# EAGLE design RelayWing (EAGLE 8.6.3)
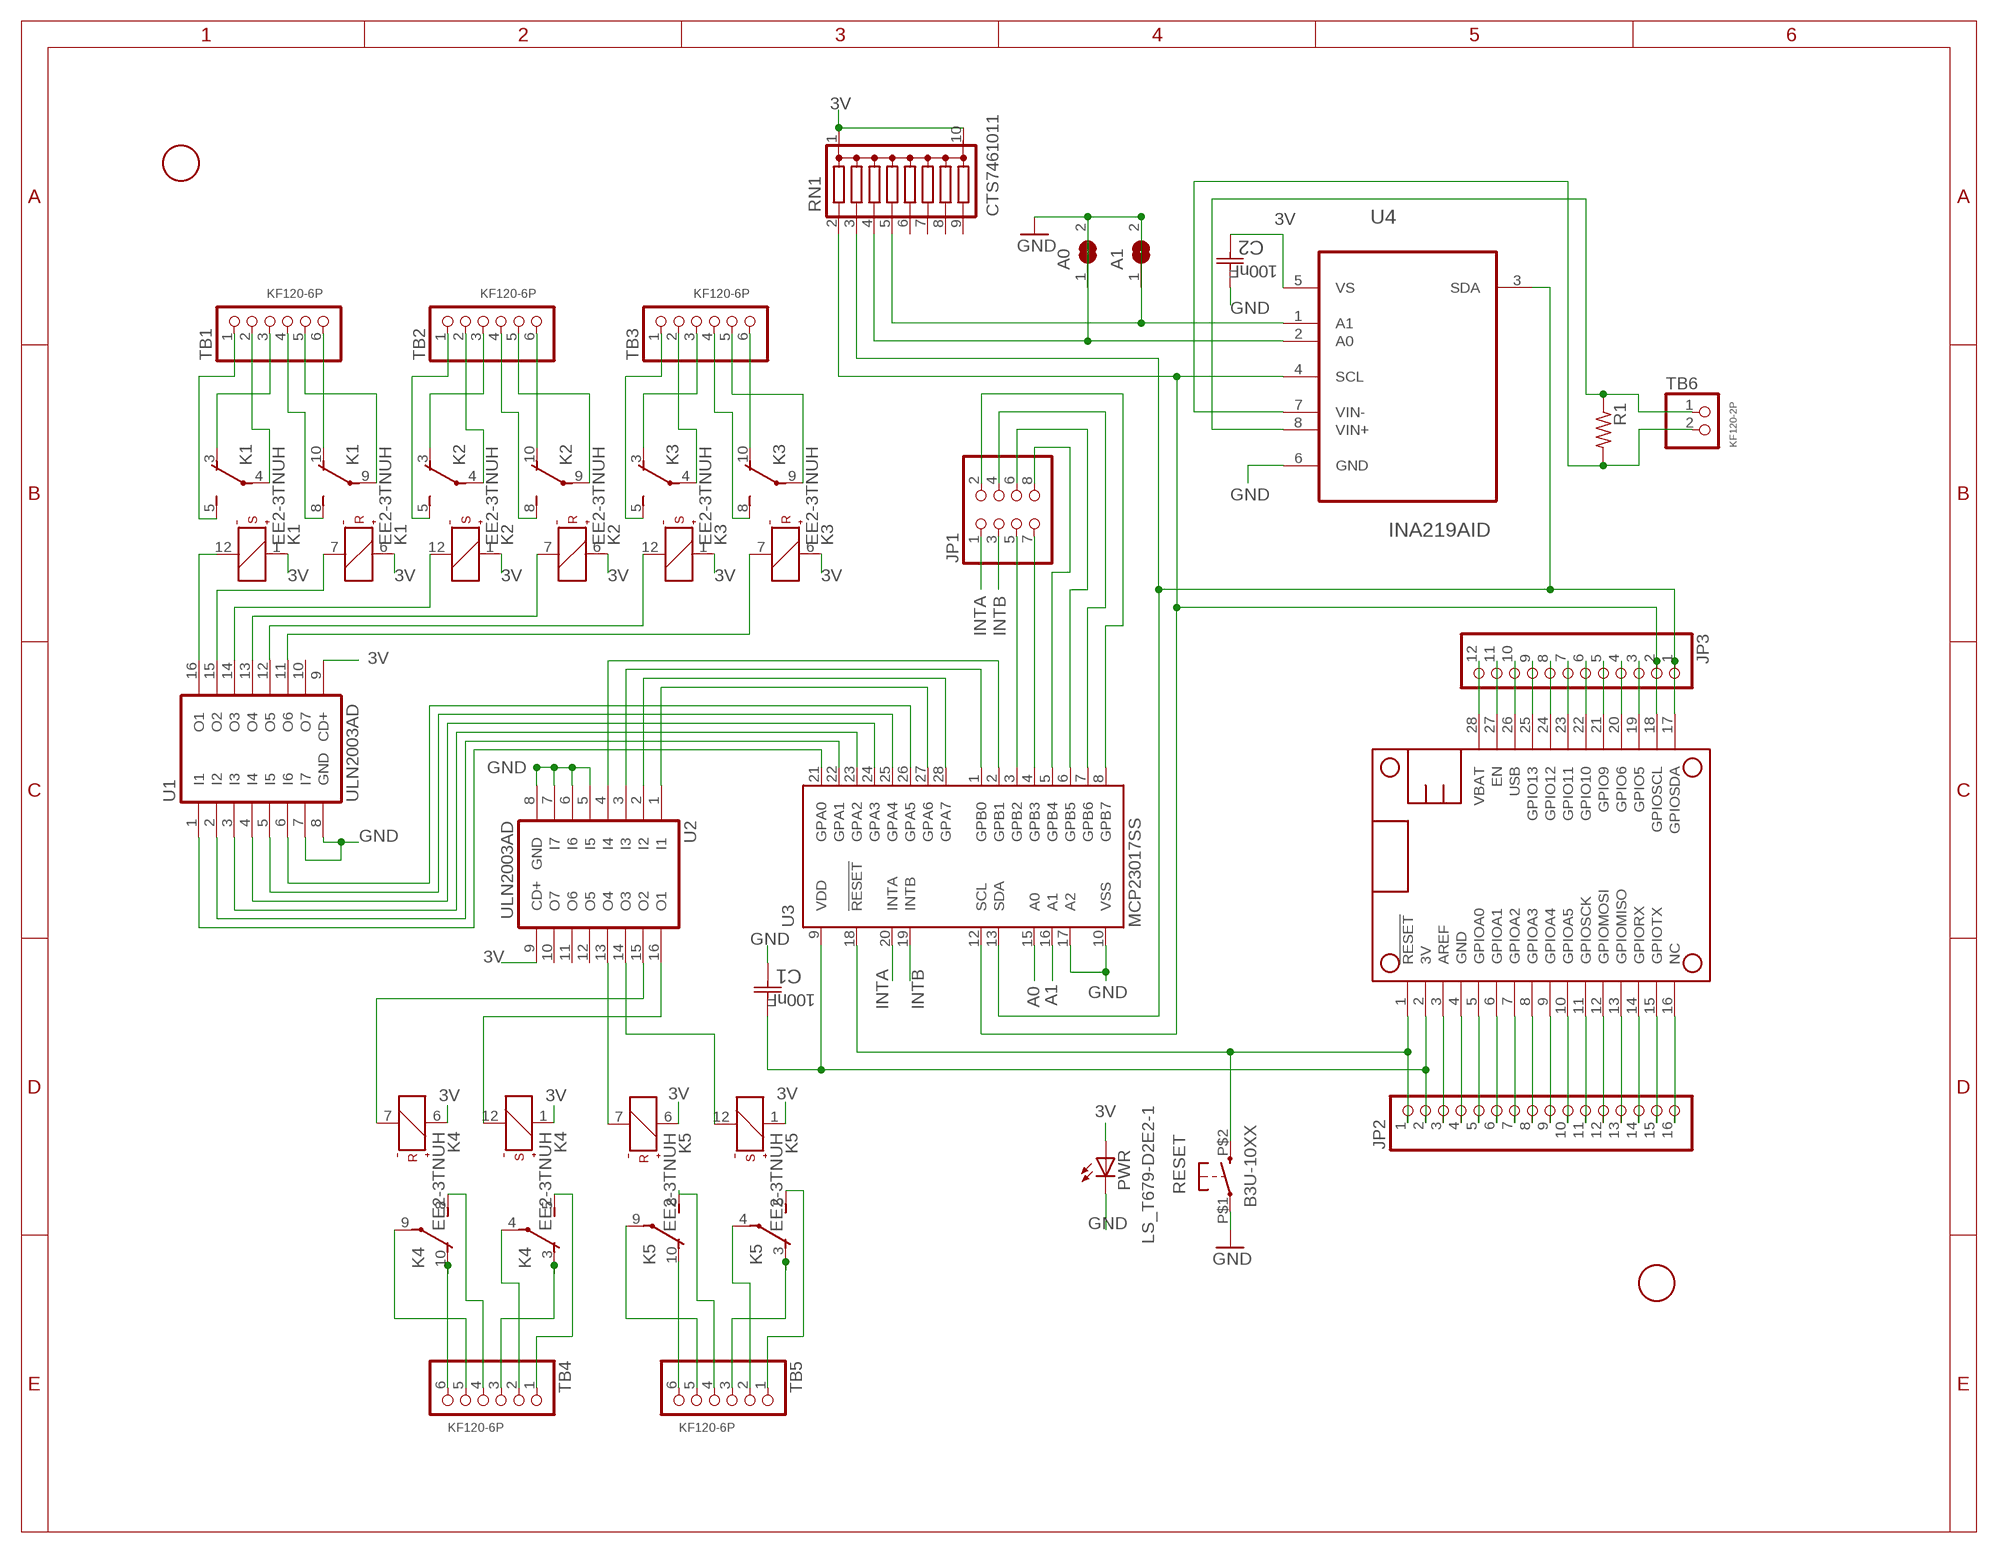
[diagram p0: schematic, sheet 1]

## Parts
A0  SJW  [SJW]
A1  SJW  [SJW]
C1  100nF  C0603C104K4RACTU  [CAPC1608X85N]
C2  100nF  C0603C104K4RACTU  [CAPC1608X85N]
JP1  PINHD-2X4  [2X04]
JP2  PINHD-1X16  [1X16]
JP3  PINHD-1X12  [1X12]
K1  EE2-3TNUH  [NUH]
K2  EE2-3TNUH  [NUH]
K3  EE2-3TNUH  [NUH]
K4  EE2-3TNUH  [NUH]
K5  EE2-3TNUH  [NUH]
MS1  FEATHERWING_NODIM  [FEATHERWING_DIM]
PWR  LS_T679-D2E2-1  [PLCC2]
R1  0.1  R-US_M3216  [M3216]
RESET  B3U-10XX  [B3U-10XX]
RN1  CTS7461011  [CTS746]
TB1  KF120-6P  [KF120-6P_ROUND]
TB2  KF120-6P  [KF120-6P_ROUND]
TB3  KF120-6P  [KF120-6P_ROUND]
TB4  KF120-6P  [KF120-6P_ROUND]
TB5  KF120-6P  [KF120-6P_ROUND]
TB6  KF120-2P  [KF120-2P_ROUND]
U1  ULN2003AD  [SO16]
U2  ULN2003AD  [SO16]
U3  MCP23017SS  [SSOP28]
U4  INA219AID  [SOIC127P600X175-8N]
U$2  FIDUCIAL  [FIDUCIAL_1MM]
U$3  FIDUCIAL  [FIDUCIAL_1MM]

## Nets
3V: C1.1(C1) C2.2(C2) JP2.2 K1.1(S:+) K1.6(R:+) K2.1(S:+) K2.6(R:+) K3.1(S:+) K3.6(R:+) K4.1(S:+) K4.6(R:+) K5.1(S:+) K5.6(R:+) MS1.2(3V) PWR.A RN1.1(1C) RN1.10(10C) U1.9(CD+) U2.9(CD+) U3.9(VDD) U4.5(VS)
A0: A0.1 RN1.4 U3.15(A0) U4.2(A0)
A1: A1.1 RN1.5 U3.16(A1) U4.1(A1)
GND: A0.2 A1.2 C1.2(C2) C2.1(C1) JP2.4 MS1.4(GND) PWR.C RESET.P$1(P) U1.7(I7) U1.8(GND) U2.5(I5) U2.6(I6) U2.7(I7) U2.8(GND) U3.10(VSS) U3.17(A2) U4.6(GND)
GPB2: JP1.5 U3.3(GPB2)
GPB3: JP1.7 U3.4(GPB3)
INTA: JP1.1 U3.20(INTA)
INTB: JP1.3 U3.19(INTB)
N$1: JP2.3 MS1.3(AREF)
N$2 [2A]: K4.8(2:S) TB4.4
N$3: JP2.5 MS1.5(GPIOA0)
N$4: JP2.6 MS1.6(GPIOA1)
N$5: JP2.7 MS1.7(GPIOA2)
N$6: JP2.8 MS1.8(GPIOA3)
N$7: JP2.9 MS1.9(GPIOA4)
N$8: JP2.10 MS1.10(GPIOA5)
N$9: JP2.11 MS1.11(GPIOSCK)
N$10: JP2.12 MS1.12(GPIOMOSI)
N$11: JP2.13 MS1.13(GPIOMISO)
N$12: JP2.14 MS1.14(GPIORX)
N$13: JP2.15 MS1.15(GPIOTX)
N$14: JP2.16 MS1.16(NC)
N$15: JP3.3 MS1.19(GPIO5)
N$16 [2A]: K1.5(1:S) TB1.1
N$17 [2A]: K2.5(1:S) TB2.1
N$18: JP2.1 MS1.1(!RESET) RESET.P$2(S) U3.18(!RESET)
N$19: JP3.4 MS1.20(GPIO6)
N$20: JP3.5 MS1.21(GPIO9)
N$21: JP3.6 MS1.22(GPIO10)
N$22: JP3.7 MS1.23(GPIO11)
N$23: JP3.8 MS1.24(GPIO12)
N$24 [coils 200mA]: K1.12(S:-) U1.16(O1)
N$25 [2A]: K4.10(2:O) TB4.6
N$26 [2A]: K2.4(1:P) TB2.2
N$27 [2A]: K2.3(1:O) TB2.3
N$28 [2A]: K1.3(1:O) TB1.3
N$29 [2A]: K1.10(2:O) TB1.6
N$30 [2A]: K1.4(1:P) TB1.2
N$32 [2A]: K1.9(2:P) TB1.5
N$33 [2A]: K2.9(2:P) TB2.5
N$34: K1.7(R:-) U1.15(O2)
N$35 [2A]: K1.8(2:S) TB1.4
N$36 [coils 200mA]: K2.12(S:-) U1.14(O3)
N$37: K2.7(R:-) U1.13(O4)
N$38: K3.12(S:-) U1.12(O5)
N$39 [coils 200mA]: K3.7(R:-) U1.11(O6)
N$40 [2A]: K4.4(1:P) TB4.2
N$42 [2A]: K4.5(1:S) TB4.1
N$43 [2A]: K5.4(1:P) TB5.2
N$44 [2A]: K5.5(1:S) TB5.1
N$45 [2A]: K5.10(2:O) TB5.6
N$46 [2A]: K5.9(2:P) TB5.5
N$47 [2A]: K5.8(2:S) TB5.4
N$49 [2A]: K4.9(2:P) TB4.5
N$50 [2A]: K5.3(1:O) TB5.3
N$51: JP3.9 MS1.25(GPIO13)
N$52 [2A]: K3.5(1:S) TB3.1
N$53 [2A]: K3.3(1:O) TB3.3
N$54 [2A]: K3.4(1:P) TB3.2
N$55 [2A]: K3.8(2:S) TB3.4
N$56 [2A]: K3.10(2:O) TB3.6
N$57 [2A]: K3.9(2:P) TB3.5
N$58 [coils 200mA]: K4.12(S:-) U2.16(O1)
N$59 [coils 200mA]: K4.7(R:-) U2.15(O2)
N$60 [coils 200mA]: K5.12(S:-) U2.14(O3)
N$61: JP3.11 MS1.27(EN)
N$62: U1.1(I1) U3.21(GPA0)
N$63: U1.2(I2) U3.22(GPA1)
N$64: U1.3(I3) U3.23(GPA2)
N$65: U1.5(I5) U3.25(GPA4)
N$66: U1.6(I6) U3.26(GPA5)
N$67: U1.4(I4) U3.24(GPA3)
N$68: U2.1(I1) U3.27(GPA6)
N$69: U2.2(I2) U3.28(GPA7)
N$70: U2.3(I3) U3.1(GPB0)
N$71: U2.4(I4) U3.2(GPB1)
N$72 [2A]: K2.8(2:S) TB2.4
N$73 [coils 200mA]: K5.7(R:-) U2.13(O4)
N$74: JP1.8 U3.5(GPB4)
N$75: JP1.6 U3.6(GPB5)
N$76: JP1.4 U3.7(GPB6)
N$77: JP1.2 U3.8(GPB7)
N$78 [2A]: K2.10(2:O) TB2.6
N$79 [2A]: K4.3(1:O) TB4.3
SCL: JP3.2 MS1.18(GPIOSCL) RN1.2 U3.12(SCL) U4.4(SCL)
SDA: JP3.1 MS1.17(GPIOSDA) RN1.3 U3.13(SDA) U4.3(SDA)
USB: JP3.10 MS1.26(USB)
VBAT: JP3.12 MS1.28(VBAT)
VIN+: R1.1 TB6.1 U4.8(VIN+)
VIN-: R1.2 TB6.2 U4.7(VIN-)
Unconnected: RN1.6 RN1.7 RN1.8 RN1.9 U1.10(O7) U2.10(O7) U2.11(O6) U2.12(O5)

## Library data of the parts
A0 A1 = jumper:SJ: SMD solder JUMPER
C1 C2 = Kemet_By_element14_Batch_1:C0603C104K4RACTU: CAPACITOR, 0603; MPN: C0603C104K4RACTU; OC_FARNELL: 1414610; OC_NEWARK: 19C6005; SUPPLIER: Kemet; TOLERANCE: ±10%; VOLTAGERATING: 16V
JP1 = pinhead:PINHD-2X4: PIN HEADER
JP2 = pinhead:PINHD-1X16: PIN HEADER
JP3 = pinhead:PINHD-1X12: PIN HEADER
K1-K5 = home:EE2-*T?: TX Relay 2 coil latching 2 AMP. HIGH CAPACITY RELAY WITH HIGH SURGE VOLTAGE & HIGH BREAKDOWN VOLTAGE Source: http://www.mew-europe.com/.. en_ds_61022_0001.pdf TX-S SMALL POLARIZED WITH HIGH SENSITIVITY 50mW Source: http://www.mew-europe.com/.. en_ds_61022_0022.pdf; PN: EE2-3TNUH
MS1 = microbuilder:FEATHERWING
PWR = led:*_T679-?-1: LC TOPLED® Low Current LED Source: http://catalog.osram-os.com .. LG_LS_LY_T679_OBS.pdf; COLOR: super-red
R1 = resistor:R-US_: RESISTOR, American symbol
RESET = home:B3U-10XX: OMRON SWITCH
RN1 = home:CTS7461011: Network Resistor CTS 753 Series Leadless Surface Mount Source: http://www.ctscorp.com/components/Datasheets/753.pdf Distributor: Digi Key
TB1-TB5 = home:KF120-6P: Kaweei KF120-6P 6-pin screw terminalblock, 0.1" spacing. Adafruit
TB6 = home:KF120-2P: Kaweei KF120-2P 2-pin screw terminal block, 0.1" spacing. Through-hole. Adafruit
U1 U2 = uln-udn:ULN2003A: DRIVER ARRAY
U3 = microchip:MCP23017: http://ww1.microchip.com/downloads/en/DeviceDoc/21952a.pdf Source: http://ww1.microchip.com/downloads/en/DeviceDoc/21952a.pdf; MF: MICROCHIP; MPN: MCP23017-E/SS; OC_FARNELL: 1467674; OC_NEWARK: 31K2960
U4 = home:INA219AID: CURRENT/ POWER MONITOR; MPN: INA219AID; OC_FARNELL: -; OC_NEWARK: 45P7635; PACKAGE: SOIC-8; SUPPLIER: Texas Instruments
U$2 U$3 = adafruit:FIDUCIAL: For use by pick and place machines to calibrate the vision/machine, 1mm By microbuilder.eu

## Net classes
0 default: width 0.203 mm, clearance 0.203 mm
1 2A: width 0.406 mm, clearance 0.203 mm
2 coils 200mA: width 0.203 mm, clearance 0.203 mm

## Board
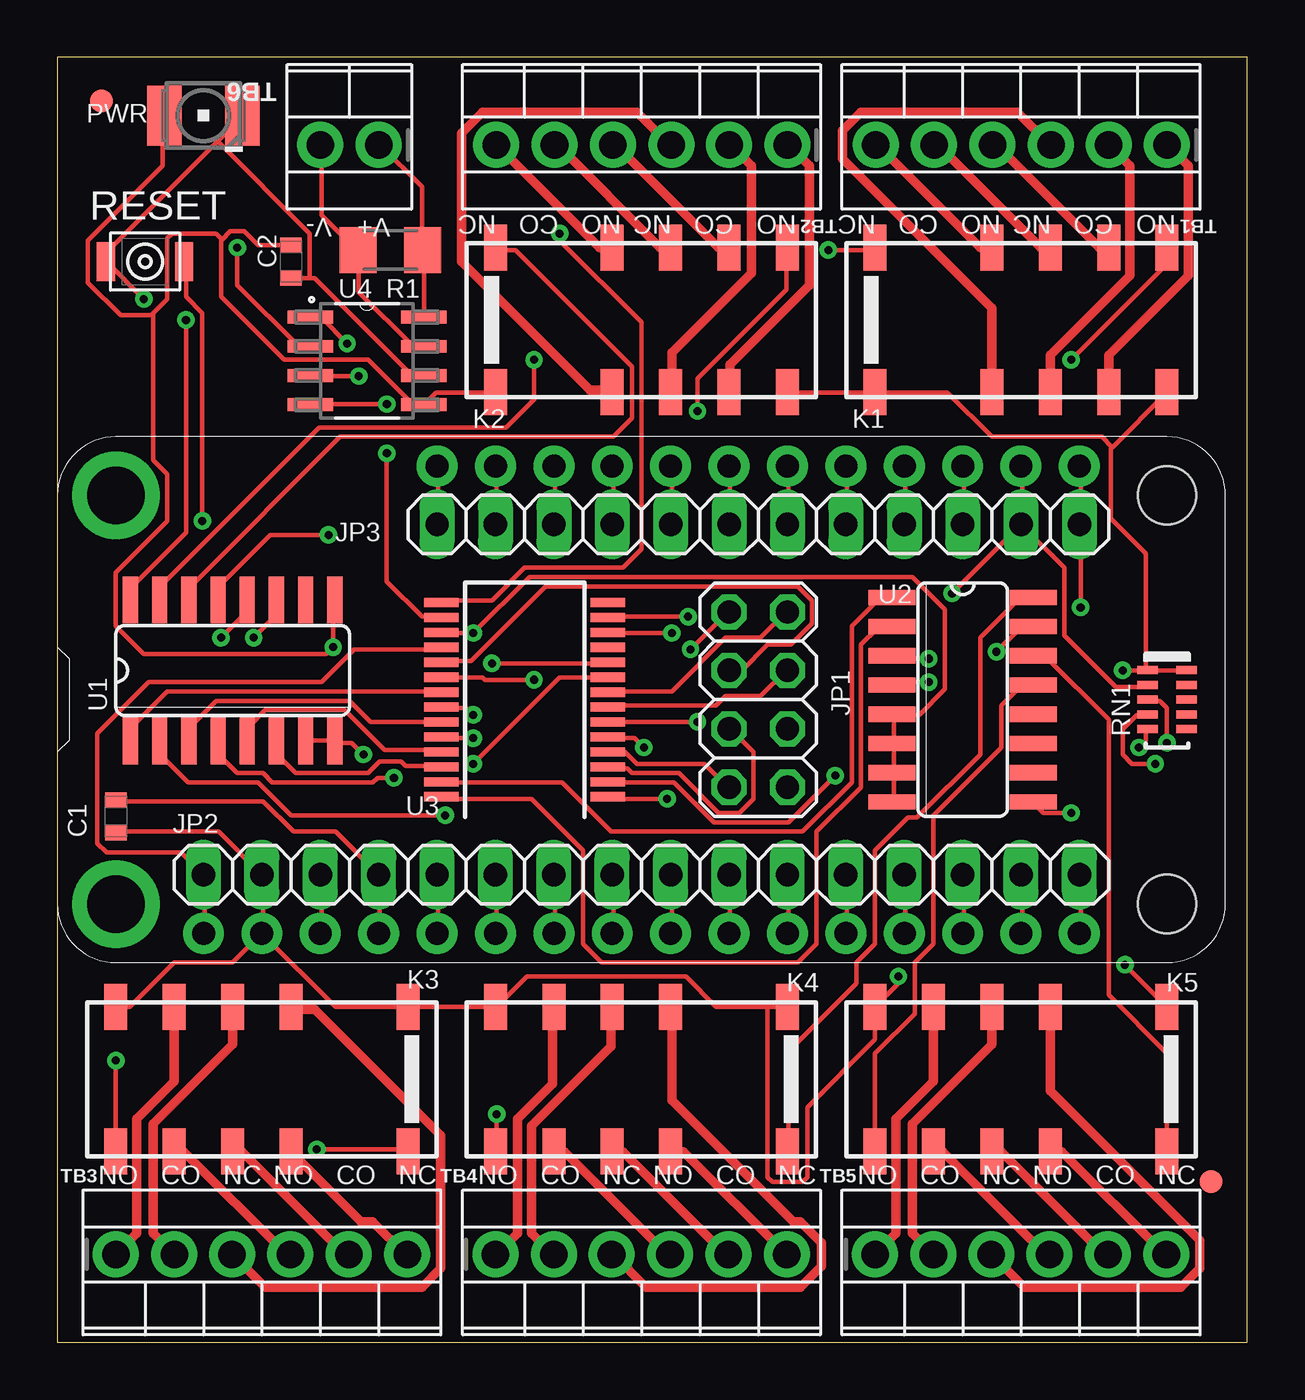
[diagram p1: board, top side]
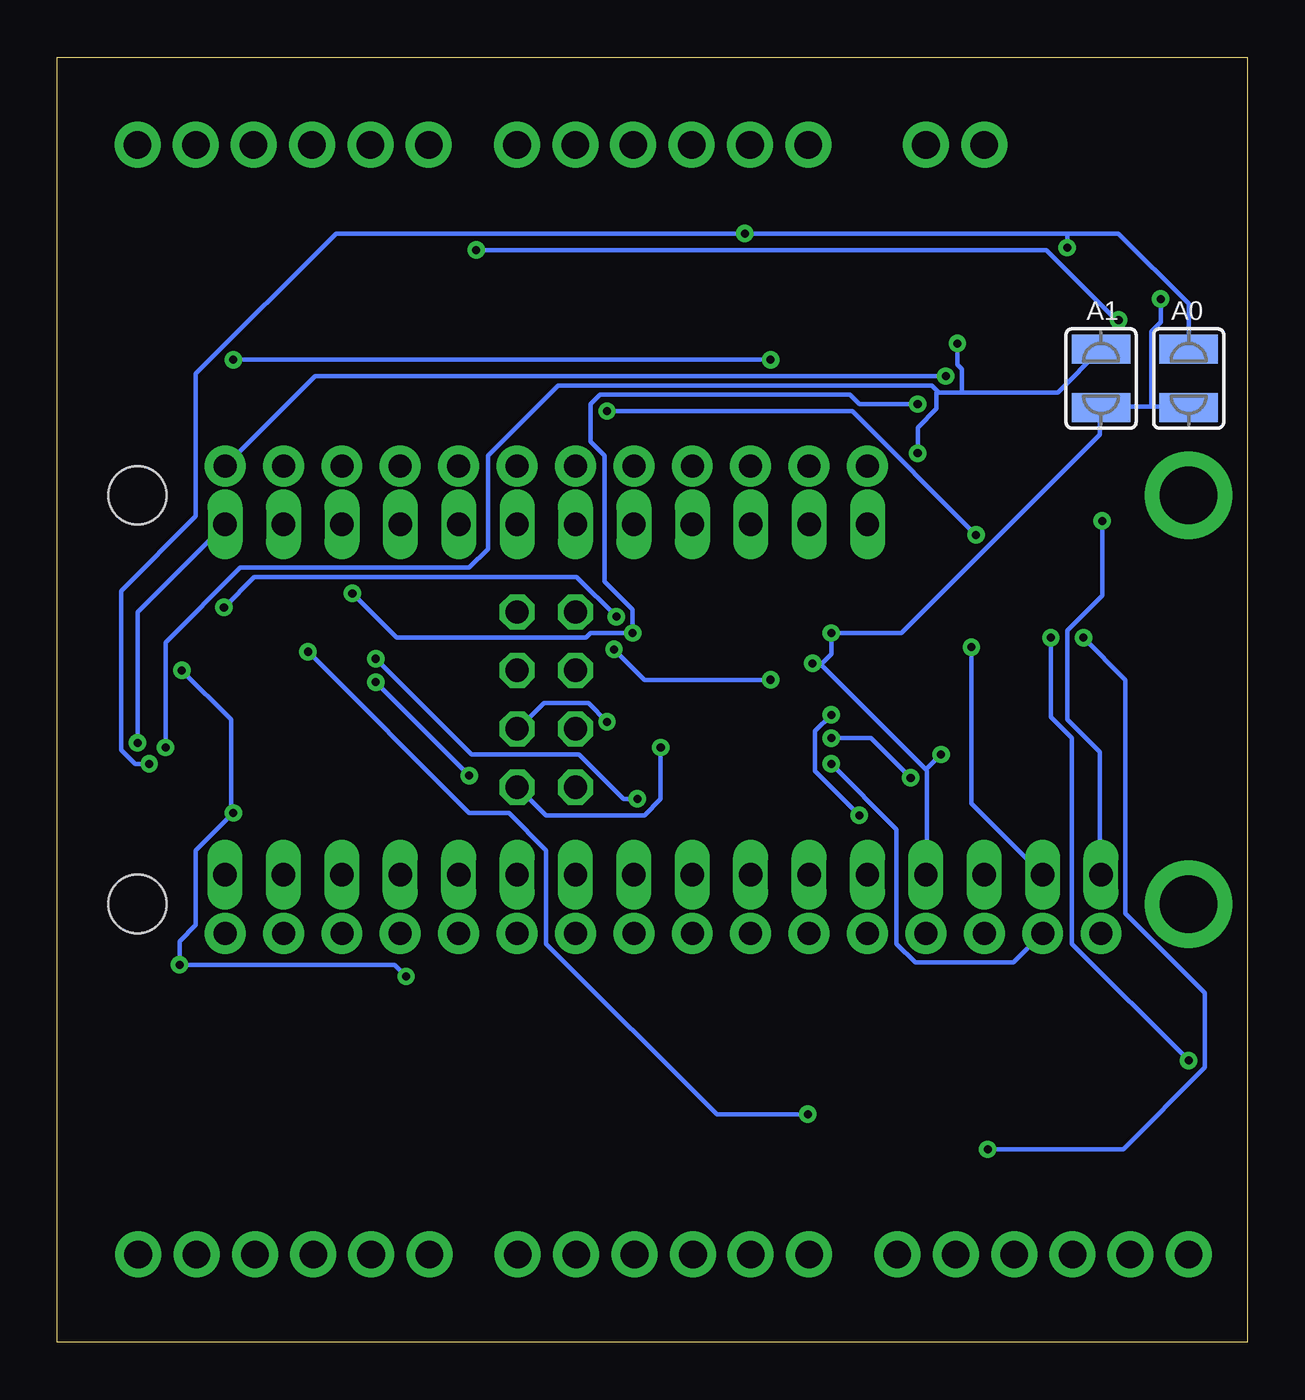
[diagram p2: board, bottom side, seen from below]

Size 51.74 x 55.87 mm. Coordinates in mm from the lower left corner, seen from the top.
Outline: 0,0 51.74,0 51.74,55.87 0,55.87 0,0
Copper layers (1*16): Top 0.035mm / dielectric 1.5mm / Bottom 0.035mm
Design rules "default": minimum track width 6mil, minimum drill 0.35mm, track to track 6mil, track to pad 6mil, pad to pad 6mil, via to via 6mil, smd to smd 6mil, copper to edge 40mil, drill to drill 6mil, minimum pad ring 10mil, minimum via ring 8mil, stop-mask expansion 4mil, vias tented up to drill 0mil, thermal gap 10mil

### Footprints (pad centres in the part's own frame; a part is rotated, then mirrored left to right if it is on the bottom)
SJW = smd 1.27 x 2.54: 1 -1.27,0; 2 1.27,0
CAPC1608X85N = smd 0.66 x 0.94: 1 -0.711,0; 2 0.711,0
2X04 = drill 1.016 octagon: 1 -3.81,-1.27; 2 -3.81,1.27; 3 -1.27,-1.27; 4 -1.27,1.27; 5 1.27,-1.27; 6 1.27,1.27; 7 3.81,-1.27; 8 3.81,1.27
1X16 = drill 1.016 long: 1 -19.05,0; 2 -16.51,0; 3 -13.97,0; 4 -11.43,0; 5 -8.89,0; 6 -6.35,0; 7 -3.81,0; 8 -1.27,0; 9 1.27,0; 10 3.81,0; 11 6.35,0; 12 8.89,0; 13 11.43,0; 14 13.97,0; 15 16.51,0; 16 19.05,0
1X12 = drill 1.016 long: 1 -13.97,0; 2 -11.43,0; 3 -8.89,0; 4 -6.35,0; 5 -3.81,0; 6 -1.27,0; 7 1.27,0; 8 3.81,0; 9 6.35,0; 10 8.89,0; 11 11.43,0; 12 13.97,0
NUH = smd 1 x 2: 1 -6.35,-3.145; 3 -1.27,-3.145; 4 1.27,-3.145; 5 3.81,-3.145; 6 6.35,-3.145; 7 6.35,3.145; 8 3.81,3.145; 9 1.27,3.145; 10 -1.27,3.145; 12 -6.35,3.145
FEATHERWING_DIM = drill 1 pad 1.778: 1 6.35,1.27; 2 8.89,1.27; 3 11.43,1.27; 4 13.97,1.27; 5 16.51,1.27; 6 19.05,1.27; 7 21.59,1.27; 8 24.13,1.27; 9 26.67,1.27; 10 29.21,1.27; 11 31.75,1.27; 12 34.29,1.27; 13 36.83,1.27; 14 39.37,1.27; 15 41.91,1.27; 16 44.45,1.27; 17 44.45,21.59; 18 41.91,21.59; 19 39.37,21.59; 20 36.83,21.59; 21 34.29,21.59; 22 31.75,21.59; 23 29.21,21.59; 24 26.67,21.59; 25 24.13,21.59; 26 21.59,21.59; 27 19.05,21.59; 28 16.51,21.59 | drill 2.5 pad 3.81: P$1 2.54,20.32; P$2 2.54,2.54 | hole 2.54: 48.26,20.32; 48.26,2.54
PLCC2 = smd 2.6 x 1.5: A 0,1.7; C 0,-1.7
M3216 = smd 1.6 x 2: 1 -1.4,0; 2 1.4,0
B3U-10XX = smd 0.8 x 1.7: P$1 -1.7,0; P$2 1.7,0
CTS746 = smd 0.35 x 0.9: 1 -1.28,-0.85; 2 -0.64,-0.85; 3 0,-0.85; 4 0.64,-0.85; 5 1.28,-0.85; 6 1.28,0.85; 7 0.64,0.85; 8 0,0.85; 9 -0.64,0.85; 10 -1.28,0.85
KF120-6P_ROUND = drill 1.2 pad 2: 1 -6.35,0; 2 -3.81,0; 3 -1.3,0; 4 1.24,0; 5 3.78,0; 6 6.32,0
KF120-2P_ROUND = drill 1.2 pad 2: 1 -1.27,0; 2 1.27,0
SO16 = smd 0.66 x 2.032: 1 -4.445,-3.073; 2 -3.175,-3.073; 3 -1.905,-3.073; 4 -0.635,-3.073; 5 0.635,-3.073; 6 1.905,-3.073; 7 3.175,-3.073; 8 4.445,-3.073; 9 4.445,3.073; 10 3.175,3.073; 11 1.905,3.073; 12 0.635,3.073; 13 -0.635,3.073; 14 -1.905,3.073; 15 -3.175,3.073; 16 -4.445,3.073
SSOP28 = smd 0.4 x 1.5: 1 -4.225,-3.625; 2 -3.575,-3.625; 3 -2.925,-3.625; 4 -2.275,-3.625; 5 -1.625,-3.625; 6 -0.975,-3.625; 7 -0.325,-3.625; 8 0.325,-3.625; 9 0.975,-3.625; 10 1.625,-3.625; 11 2.275,-3.625; 12 2.925,-3.625; 13 3.575,-3.625; 14 4.225,-3.625; 15 4.225,3.625; 16 3.575,3.625; 17 2.925,3.625; 18 2.275,3.625; 19 1.625,3.625; 20 0.975,3.625; 21 0.325,3.625; 22 -0.325,3.625; 23 -0.975,3.625; 24 -1.625,3.625; 25 -2.275,3.625; 26 -2.925,3.625; 27 -3.575,3.625; 28 -4.225,3.625
SOIC127P600X175-8N = smd 1.981 x 0.559: 1 -2.464,1.905; 2 -2.464,0.635; 3 -2.464,-0.635; 4 -2.464,-1.905; 5 2.464,-1.905; 6 2.464,-0.635; 7 2.464,0.635; 8 2.464,1.905
FIDUCIAL_1MM = smd 1 x 1: 1 0,0

### Placement (x,y rotation side)
A0  2.54,41.91 270 bottom
A1  6.35,41.91 270 bottom
C1  2.54,22.86 90 top
C2  10.16,46.99 90 top
JP1  30.48,27.94 270 top
JP2  25.4,20.32 0 top
JP3  30.48,35.56 180 top
K1  41.91,44.45 0 top
K2  25.4,44.45 0 top
K3  8.89,11.43 180 top
K4  25.4,11.43 180 top
K5  41.91,11.43 180 top
MS1  0,16.51 0 top
PWR  6.35,53.34 90 top
R1  14.48,47.5 180 top
RESET  3.81,46.99 0 top
RN1  48.26,27.94 270 top
TB1  41.91,52.07 180 top
TB2  25.4,52.07 180 top
TB3  8.89,3.81 0 top
TB4  25.4,3.81 0 top
TB5  41.91,3.81 0 top
TB6  12.7,52.07 180 top
U1  7.62,29.21 0 top
U2  39.37,27.94 270 top
U3  20.32,27.94 90 top
U4  13.46,42.67 0 top
U$2  1.91,53.97 0 top
U$3  50.16,6.98 0 top

### Tracks (layer width: path | path; a pad name or v marks a point on that pad's centre or on a via)
3V  (via drill 0.35)
  Top 0.203: v46.43,16.41 K5.1 | v44.09,23.01 42.88,23.01 42.47,23.42 U2.9 | K1.1 31.8,41.3 K2.6 | RN1.1 47.45,29.21 49.07,29.21 RN1.10 | 45.87,38.91 K1.6 | 45.87,38.91 45.82,38.86 45.82,35.81 47.35,34.29 47.35,29.31 RN1.1 | K1.1 38.71,41.3 40.64,39.37 45.41,39.37 45.87,38.91 | K1.1 | v46.33,29.21 47.35,29.21 RN1.1 | C2.2 8.74,47.7 8.13,48.31 7.52,48.31 7.16,47.95 | 7.16,47.95 7.11,47.9 7.11,45.47 9.86,42.72 13.51,42.72 15.44,40.79 15.85,40.79 U4.5 16.46,41.3 19,41.3 K2.1 | 4.12,44.7 4.78,45.36 4.78,48.01 4.98,48.21 6.91,48.21 7.16,47.95 | 4.12,44.7 4.06,44.65 2.74,44.65 1.32,46.08 1.32,47.9 4.57,51.16 4.57,53.29 PWR.A | K3.1 19,14.58 K4.6 19.1,14.58 20.42,15.9 27.33,15.9 28.65,14.58 30.89,14.58 | 30.89,14.58 31.7,14.58 K4.1 | 30.89,14.58 30.89,7.16 31.09,6.96 32.41,6.96 32.61,7.16 32.61,10.21 35.56,13.16 K5.6 36.58,15.6 v36.58,15.9 | C1.1 2.54,22.2 7.01,22.2 JP2.2 8.94,20.27 8.94,17.83 MS1.2 | U1.9 11.99,32.26 v11.99,30.23 11.68,29.92 3.76,29.92 2.54,31.14 2.54,33.48 4.78,35.71 4.78,37.74 4.17,38.35 4.17,44.65 4.12,44.7 | v18.09,25.15 21.84,28.91 23.88,28.91 U3.9 | MS1.2 7.62,16.51 5.08,16.51 3.15,14.58 K3.6 | K3.1 12.09,14.58 MS1.2 | K3.1
  Bottom 0.203: v46.33,29.21 44.2,27.08 44.2,23.01 v44.09,23.01 45.72,21.39 45.72,18.14 46.43,17.42 v46.43,16.41 37.08,16.41 v36.58,15.9 | v11.99,30.23 11.99,23.42 JP2.2 | v18.09,25.15 15.24,22.3 15.24,17.32 14.43,16.51 10.16,16.51 MS1.2
A0  (via drill 0.35)
  Top 0.203: v47.75,25.15 46.74,25.15 46.33,25.55 46.33,26.67 46.94,27.28 47.35,27.28 RN1.4 | v21.84,48.21 21.84,47.9 25.4,44.35 25.4,34.49 24.59,33.68 20.32,33.68 18.9,32.26 16.76,32.26 U3.15 | v7.82,47.6 7.82,45.97 10.46,43.33 10.97,43.33 U4.2
  Bottom 0.203: v47.75,25.15 48.36,25.15 48.97,25.76 48.97,32.66 45.72,35.92 45.72,42.11 39.62,48.21 v21.84,48.21 7.82,48.21 | 7.82,48.21 5.59,48.21 2.54,45.16 A0.1 | 7.82,48.21 v7.82,47.6
A1  (via drill 0.35)
  Top 0.203: v47.04,25.86 47.35,26.16 47.35,26.57 RN1.5 | v14.33,38.66 14.33,33.07 15.85,31.55 16.66,31.55 U3.16 | v12.6,43.43 11.48,44.55 11.07,44.55 U4.1
  Bottom 0.203: v47.04,25.86 47.04,30.43 43.79,33.68 33.83,33.68 33.02,34.49 33.02,38.56 29.97,41.61 13.72,41.61 13.46,41.35 | 13.46,41.35 13.41,41.3 12.39,41.3 | 12.39,41.3 8.23,41.3 A1.1 | v14.33,38.66 14.33,39.78 13.51,40.59 13.51,41.3 13.46,41.35 | v12.6,43.43 12.6,42.52 12.39,42.32 12.39,41.3
GND  (via drill 0.35)
  Top 0.203: 10.97,46.28 11.18,46.28 15.34,42.11 15.85,42.11 U4.6 | 10.97,46.28 C2.1 | 2.13,46.99 2.13,47.4 6.96,52.22 | 6.96,52.22 8.03,53.29 PWR.C | 10.97,46.28 10.97,48.21 6.96,52.22 | U2.8 36.37,23.52 36.37,24.74 U2.7 36.37,24.84 36.37,25.96 U2.6 36.37,26.06 36.37,27.28 U2.5 36.47,27.28 37.49,27.28 38.61,28.4 38.61,31.85 37.19,33.27 20.52,33.27 v18.09,30.84 16.76,30.84 U3.17 | U1.7 10.87,26.16 11.99,26.16 U1.8 12.09,26.06 12.8,26.06 v13.31,25.55 | C1.2 2.54,23.52 8.94,23.52 10.26,22.2 12.09,22.2 JP2.4 14.02,20.27 14.02,17.83 MS1.4 | v18.9,29.52 23.88,29.52 U3.10 | v3.76,45.36 2.13,46.99 | 2.13,46.99 RESET.P$1
  Bottom 0.203: 4.17,40.69 6.3,40.69 A1.2 6.4,40.59 6.4,39.47 15.04,30.84 v18.09,30.84 18.09,29.92 18.54,29.46 | 4.17,40.69 2.54,40.69 A0.2 | v18.9,29.52 18.59,29.52 18.54,29.46 | 13.97,24.89 13.92,24.84 13.92,20.37 JP2.4 | 13.97,24.89 18.54,29.46 | 13.97,24.89 v13.31,25.55 | v3.76,45.36 3.76,44.35 4.17,43.94 4.17,40.69
GPB2
  Top 0.203: U3.3 23.98,24.94 24.79,24.94 24.99,24.74 27.03,24.74 28.75,23.01 29.67,23.01 30.28,23.62 30.28,25.65 29.26,26.67 JP1.5
GPB3
  Top 0.203: U3.4 23.98,25.65 24.69,25.65 25.2,25.15 28.14,25.15 29.16,24.13 JP1.7
INTA  (via drill 0.35)
  Top 0.203: v20.73,28.8 18.59,28.8 18.49,28.91 16.76,28.91 U3.20 | v27.53,30.12 29.16,31.75 JP1.1
  Bottom 0.203: v20.73,28.8 26.21,28.8 v27.53,30.12
INTB
  Top 0.203: JP1.3 29.77,29.21 30.89,30.33 31.9,30.33 32.82,31.24 32.82,32.26 32.21,32.87 21.23,32.87 17.98,29.62 16.76,29.62 U3.19
N$1
  Top 0.203: JP2.3 11.48,20.27 11.48,17.83 MS1.3
N$2
  Top 0.406: TB4.4 26.52,3.81 22.05,8.28 21.64,8.28 K4.8
N$3
  Top 0.203: JP2.5 16.56,20.27 16.56,17.83 MS1.5
N$4
  Top 0.203: JP2.6 19.1,20.27 19.1,17.83 MS1.6
N$5
  Top 0.203: JP2.7 21.64,20.27 21.64,17.83 MS1.7
N$6
  Top 0.203: JP2.8 24.18,20.27 24.18,17.83 MS1.8
N$7
  Top 0.203: JP2.9 26.72,20.27 26.72,17.83 MS1.9
N$8
  Top 0.203: JP2.10 29.26,20.27 29.26,17.83 MS1.10
N$9
  Top 0.203: JP2.11 31.8,20.27 31.8,17.83 MS1.11
N$10
  Top 0.203: JP2.12 34.34,20.27 34.34,17.83 MS1.12
N$11
  Top 0.203: JP2.13 36.88,20.27 36.88,17.83 MS1.13
N$12
  Top 0.203: JP2.14 39.42,20.27 39.42,17.83 MS1.14
N$13
  Top 0.203: JP2.15 41.96,20.27 41.96,17.83 MS1.15
N$14
  Top 0.203: JP2.16 44.5,20.27 44.5,17.83 MS1.16
N$15
  Top 0.203: JP3.3 39.42,35.61 39.42,38.05 MS1.19
N$16
  Top 0.406: K1.5 45.72,42.93 49.17,46.38 49.17,51.16 TB1.1
N$17
  Top 0.406: K2.5 29.26,41.4 29.26,42.52 32.72,45.97 32.72,51.16 31.8,52.07 TB2.1
N$18  (via drill 0.35)
  Top 0.203: U3.18 16.66,30.12 12.9,30.12 11.48,28.7 3.96,28.7 1.73,26.47 1.73,21.69 2.13,21.29 5.38,21.29 JP2.1 6.4,20.27 6.4,17.83 MS1.1 | v6.3,35.71 6.3,44.76 5.59,45.47 5.59,46.99 RESET.P$2
  Bottom 0.203: v6.3,35.71 6.3,32.46 7.82,30.94 7.82,27.08 6.4,25.65 6.4,20.37 JP2.1
N$19
  Top 0.203: JP3.4 36.88,35.61 36.88,38.05 MS1.20
N$20
  Top 0.203: JP3.5 34.34,35.61 34.34,38.05 MS1.21
N$21
  Top 0.203: JP3.6 31.8,35.61 31.8,38.05 MS1.22
N$22
  Top 0.203: JP3.7 29.26,35.61 29.26,38.05 MS1.23
N$23
  Top 0.203: JP3.8 26.72,35.61 26.72,38.05 MS1.24
N$24  (via drill 0.35)
  Top 0.203: v33.53,47.5 35.56,47.5 K1.12 | v5.59,44.45 5.59,35.2 3.25,32.87 3.25,32.36 U1.16
  Bottom 0.203: v33.53,47.5 8.74,47.5 5.69,44.45 v5.59,44.45
N$25
  Top 0.406: K4.10 26.72,8.28 27.23,8.28 31.7,3.81 TB4.6
N$26
  Top 0.406: K2.4 26.72,41.4 26.72,43.03 30.18,46.48 30.18,51.16 29.26,52.07 TB2.2
N$27
  Top 0.406: K2.3 24.08,41.4 23.16,41.4 17.58,46.99 17.58,52.58 18.49,53.49 25.2,53.49 26.62,52.07 TB2.3
N$28
  Top 0.406: K1.3 40.64,44.96 34.14,51.46 34.14,52.68 34.95,53.49 41.76,53.49 43.18,52.07 TB1.3
N$29
  Top 0.406: K1.10 40.13,47.6 35.66,52.07 TB1.6
N$30
  Top 0.406: K1.4 43.18,42.93 46.63,46.38 46.63,51.16 TB1.2
N$32
  Top 0.406: TB1.5 38.3,52.07 42.77,47.6 K1.9
N$33
  Top 0.406: TB2.5 21.74,52.07 26.21,47.6 26.62,47.6 K2.9
N$34  (via drill 0.35)
  Top 0.203: K1.7 48.26,46.89 v44.09,42.72 | v20.73,42.72 20.73,41 19.51,39.78 11.38,39.78 4.47,32.87 4.47,32.36 U1.15
  Bottom 0.203: v20.73,42.72 v44.09,42.72
N$35
  Top 0.406: TB1.4 40.84,52.07 45.31,47.6 K1.8
N$36
  Top 0.203: K2.12 19.1,47.5 19.91,47.5 24.99,42.42 24.99,40.18 24.18,39.37 12.29,39.37 5.79,32.87 5.79,32.36 U1.14
N$37  (via drill 0.35)
  Top 0.203: v27.84,40.49 27.84,41.91 31.7,45.77 31.7,47.5 K2.7 | v11.79,35.1 9.25,35.1 7.01,32.87 7.01,32.36 U1.13
  Bottom 0.203: v27.84,40.49 17.17,40.49 v11.79,35.1
N$38  (via drill 0.35)
  Top 0.203: v11.28,8.38 15.24,8.38 K3.12 | v7.11,30.63 8.23,31.75 8.23,32.26 U1.12
  Bottom 0.203: v11.28,8.38 5.38,8.38 1.83,11.94 1.83,15.19 5.28,18.64 5.28,28.8 v7.11,30.63
N$39  (via drill 0.35)
  Top 0.203: v2.54,12.24 K3.7 | v8.53,30.63 9.45,31.55 9.45,32.26 U1.11
  Bottom 0.203: v2.54,12.24 7.62,17.32 7.62,26.26 8.53,27.18 v8.53,30.63
N$40
  Top 0.406: K4.4 24.08,14.48 24.08,12.85 20.62,9.4 20.62,4.72 21.54,3.81 TB4.2
N$42
  Top 0.406: K4.5 21.54,14.48 21.54,11.23 20.02,9.7 20.02,4.72 19.1,3.81 TB4.1
N$43
  Top 0.406: K5.4 40.64,12.95 37.19,9.5 37.19,4.72 TB5.2
N$44
  Top 0.406: K5.5 38.1,11.33 36.47,9.7 36.47,4.72 TB5.1
N$45
  Top 0.406: K5.10 43.69,8.28 48.16,3.81 TB5.6
N$46
  Top 0.406: TB5.5 45.52,3.81 41.05,8.28 K5.9
N$47
  Top 0.406: TB5.4 42.98,3.81 38.51,8.28 K5.8
N$49
  Top 0.406: TB4.5 29.06,3.81 24.59,8.28 24.18,8.28 K4.9
N$50
  Top 0.406: K5.3 43.18,10.92 49.68,4.42 49.68,3.2 48.87,2.39 42.06,2.39 40.64,3.81 TB5.3
N$51
  Top 0.203: JP3.9 24.18,35.61 24.18,38.05 MS1.25
N$52
  Top 0.406: K3.5 5.08,11.33 3.45,9.7 3.45,4.72 TB3.1
N$53
  Top 0.406: K3.3 10.16,14.48 11.18,14.48 16.66,8.99 16.66,3.2 15.85,2.39 9.04,2.39 7.62,3.81 TB3.3
N$54
  Top 0.406: K3.4 7.62,12.95 4.17,9.5 4.17,4.72 TB3.2
N$55
  Top 0.406: TB3.4 9.96,3.81 5.49,8.28 K3.8
N$56
  Top 0.406: K3.10 13.21,5.23 13.72,5.23 15.14,3.81 TB3.6
N$57
  Top 0.406: TB3.5 12.5,3.81 8.03,8.28 K3.9
N$58
  Top 0.203: K4.12 31.8,8.38 31.8,12.65 34.75,15.6 34.75,16.51 35.56,17.32 35.56,21.39 36.98,22.81 37.39,22.81 40.13,25.55 40.13,30.63 41.86,32.36 42.37,32.36 U2.16
N$59  (via drill 0.35)
  Top 0.203: v19.1,9.91 19.1,8.38 K4.7 | v40.84,30.02 41.86,31.04 42.37,31.04 U2.15
  Bottom 0.203: v19.1,9.91 23.06,9.91 30.48,17.32 30.48,21.39 32.11,23.01 33.83,23.01 v40.84,30.02
N$60
  Top 0.203: K5.12 48.26,12.55 45.72,15.09 45.72,27.08 42.98,29.82 42.47,29.82 U2.14
N$61
  Top 0.203: JP3.11 19.1,35.61 19.1,38.05 MS1.27
N$62
  Top 0.203: U3.21 16.66,28.3 4.78,28.3 3.25,26.77 3.25,26.16 U1.1
N$63  (via drill 0.35)
  Top 0.203: v18.09,27.28 17.78,27.58 16.76,27.58 U3.22 | v16.87,22.91 10.16,22.91 8.74,24.33 5.69,24.33 4.47,25.55 4.47,26.06 U1.2
  Bottom 0.203: v18.09,27.28 18.8,26.57 18.8,24.84 v16.87,22.91
N$64
  Top 0.203: U3.23 16.66,26.98 13.61,26.98 12.7,27.89 6.91,27.89 5.79,26.77 5.79,26.16 U1.3
N$65
  Top 0.203: U3.25 16.66,25.76 14.22,25.76 12.5,27.48 9.04,27.48 8.33,26.77 8.33,26.16 U1.5
N$66
  Top 0.203: U3.26 16.66,25.04 15.14,25.04 14.94,25.25 14.02,25.25 13.51,24.74 10.36,24.74 9.55,25.55 9.55,26.06 U1.6
N$67  (via drill 0.35)
  Top 0.203: v18.09,26.26 16.76,26.26 U3.24 | v14.63,24.54 13.92,24.54 13.72,24.33 9.35,24.33 8.94,24.74 7.82,24.74 7.01,25.55 7.01,26.06 U1.4
  Bottom 0.203: v18.09,26.26 16.36,26.26 v14.63,24.54
N$68
  Top 0.203: U3.27 16.76,24.33 21.95,24.33 24.08,22.2 32.41,22.2 34.54,24.33 34.54,31.14 35.76,32.36 36.27,32.36 U2.1
N$69
  Top 0.203: U3.28 16.76,23.62 20.62,23.62 22.86,21.39 22.86,17.32 23.67,16.51 32.21,16.51 33.02,17.32 33.02,22.2 34.95,24.13 34.95,30.33 35.66,31.04 36.27,31.04 U2.2
N$70  (via drill 0.35)
  Top 0.203: v26.52,23.62 23.98,23.62 U3.1 | v37.9,29.72 36.47,29.72 36.37,29.82 U2.3
  Bottom 0.203: v26.52,23.62 27.13,23.62 29.06,25.55 33.73,25.55 v37.9,29.72
N$71  (via drill 0.35)
  Top 0.203: v33.83,24.64 31.8,22.61 28.55,22.61 26.82,24.33 23.98,24.33 U3.2 | v37.9,28.7 36.47,28.7 36.37,28.6 U2.4
  Bottom 0.203: v37.9,28.7 v33.83,24.64
N$72
  Top 0.406: TB2.4 24.28,52.07 28.75,47.6 29.16,47.6 K2.8
N$73
  Top 0.203: K5.7 35.56,12.55 37.29,14.28 37.29,16.51 38.1,17.32 38.1,22.91 41.05,25.86 41.05,27.69 41.86,28.5 42.37,28.5 U2.13
N$74  (via drill 0.35)
  Top 0.203: v25.5,25.86 25.09,26.26 23.98,26.26 U3.5
  Bottom 0.203: v25.5,25.86 25.5,23.62 26.21,22.91 30.48,22.91 31.7,24.13 JP1.8
N$75  (via drill 0.35)
  Top 0.203: v27.84,26.98 23.98,26.98 U3.6
  Bottom 0.203: v27.84,26.98 28.65,27.79 30.58,27.79 31.7,26.67 JP1.6
N$76
  Top 0.203: U3.7 23.98,27.69 28.65,27.69 29.06,28.09 30.58,28.09 31.7,29.21 JP1.4
N$77
  Top 0.203: U3.8 23.98,28.3 26.72,28.3 29.06,30.63 30.58,30.63 31.7,31.75 JP1.2
N$78
  Top 0.406: K2.10 24.08,47.6 23.57,47.6 19.1,52.07 TB2.6
N$79
  Top 0.406: K4.3 26.72,14.48 26.72,10.52 32,5.23 32.31,5.23 33.22,4.32 33.22,3.3 32.31,2.39 25.6,2.39 24.18,3.81 TB4.3
SCL  (via drill 0.35)
  Top 0.203: JP3.2 43.79,33.68 43.79,30.73 46.02,28.5 47.35,28.5 RN1.2 | v26.72,30.84 23.98,30.84 U3.12 | JP3.2 v38.91,32.56 | v14.33,40.79 11.07,40.79 U4.4 | MS1.18 41.96,38.05 41.96,35.61 JP3.2
  Bottom 0.203: v38.91,32.56 36.98,30.63 28.75,30.63 28.55,30.84 v26.72,30.84 26.72,31.85 27.94,33.07 27.94,38.56 28.55,39.17 28.55,40.79 28.14,41.2 17.27,41.2 16.87,40.79 v14.33,40.79
SDA  (via drill 0.35)
  Top 0.203: v48.26,26.06 48.26,27.58 47.95,27.89 47.45,27.89 RN1.3 | v27.43,31.55 23.98,31.55 U3.13 | v44.5,31.95 44.5,35.51 JP3.1 44.5,35.61 44.5,38.05 MS1.17 | v13.11,42.01 11.07,42.01 U4.3
  Bottom 0.203: v48.26,26.06 48.26,31.75 JP3.1 | v27.43,31.55 29.16,33.27 43.18,33.27 v44.5,31.95 | v13.11,42.01 40.54,42.01 MS1.17
USB
  Top 0.203: JP3.10 21.64,35.61 21.64,38.05 MS1.26
VBAT
  Top 0.203: JP3.12 16.56,35.61 16.56,38.05 MS1.28
VIN+
  Top 0.203: U4.8 15.95,44.65 15.95,47.5 R1.1 15.85,47.5 15.85,50.24 14.02,52.07 TB6.1
VIN-
  Top 0.203: U4.7 15.85,43.33 15.44,43.33 13.11,45.67 13.11,47.5 R1.2 13.01,47.5 11.48,49.02 11.48,52.07 TB6.2

### Text on the board
tPlace: V- | V+ | NO CO NC | NO CO NC | NO CO NC | NO CO NC | NO CO NC | NO CO NC | NO CO NC | NO CO NC | NO CO NC | NO CO NC